# Altium schematic sheet Memory.SchDoc
size A4
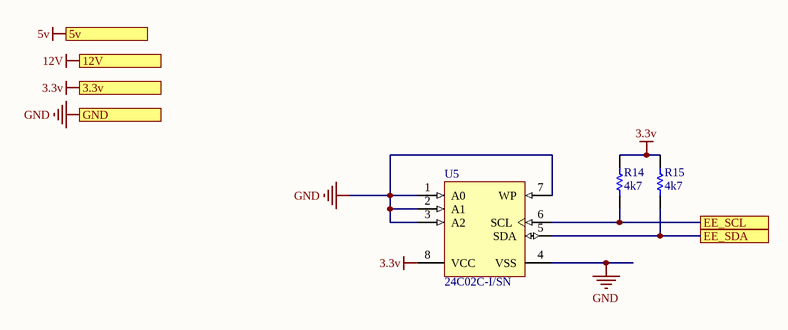
[diagram p0: Memory.SchDoc]

## Parts
R14  value 4k7  [RES 0805 (2012X06L)]  (hidden comment: Res1)
R15  value 4k7  [RES 0805 optional]  (hidden comment: Res1)
U5  24C02C-I/SN  [SOIC-SN8_L]

## Ports
3.3v, 5v, 12V, EE_SCL, EE_SDA, GND

## Nets
3.3v: R14.2 R15.2 U5.8(VCC) ; port 3.3v
5v: port 5v
12V: port 12V
GND: U5.1(A0) U5.2(A1) U5.3(A2) U5.4(VSS) U5.7(WP) ; port GND
EE_SCL: R14.1 U5.6(SCL) ; port EE_SCL
EE_SDA: R15.1 U5.5(SDA) ; port EE_SDA

## Library data of the parts
R14 R15 = Res1: Resistor; Published: 8-Jun-2000; LatestRevisionDate: 17-Jul-2002; LatestRevisionNote: Re-released for DXP Platform.; PackageReference: AXIAL-0.3; Publisher: Altium Limited
U5 = 24C02C-I/SN: 2Kbit, 400kHz, 5V, I2C Serial EEPROM, 8-Pin SOIC 150mil, Industrial Temperature; Published: 29-Jan-2009; DatasheetVersion: revJ, Aug-2008; PackageVersion: revBB, Aug-2009; PackageReference: SOIC-SN8; Publisher: Altium Limited; PackageDescription: 8-Lead Plastic Small Outline (SN) - Narrow, 3.90mm Body [SOIC]; Supplier 1: Digi-Key; Supplier Part Number 1: 24C02C-I/SN-ND; Supplier 2: Farnell; Supplier Part Number 2: 1084339; Code_JEDEC: MS-012; Code_IPC: SOIC127P600-8; ComponentLink1Description: Datasheet; ComponentLink1URL: http://ww1.microchip.com/downloads/en/DeviceDoc/21202J.pdf; ComponentLink2Description: Packaging Specification; ComponentLink2URL: http://www.microchip.com/stellent/groups/techpub_sg/documents/packagingspec/en012702.pdf; ComponentLink3Description: Microchip.com Home; ComponentLink3URL: http://www.microchip.com/